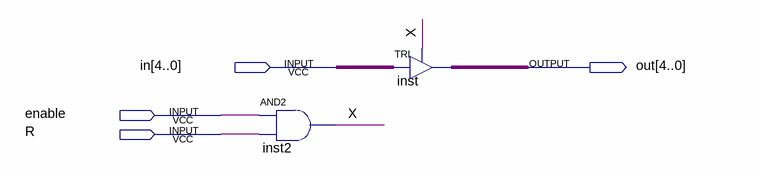
[diagram p0: schematic sheet]
// Quartus schematic acessoRAM.bdf as structural Verilog: 2 symbols, 4 pins
module acessoRAM (
  input  [4:0] in,
  input  enable,
  input  R,
  output [4:0] out
);

  wire X;

  and inst2 (X, enable, R);
  TRI inst[4:0] (.IN(in), .OE(X), .OUT(out));
endmodule
